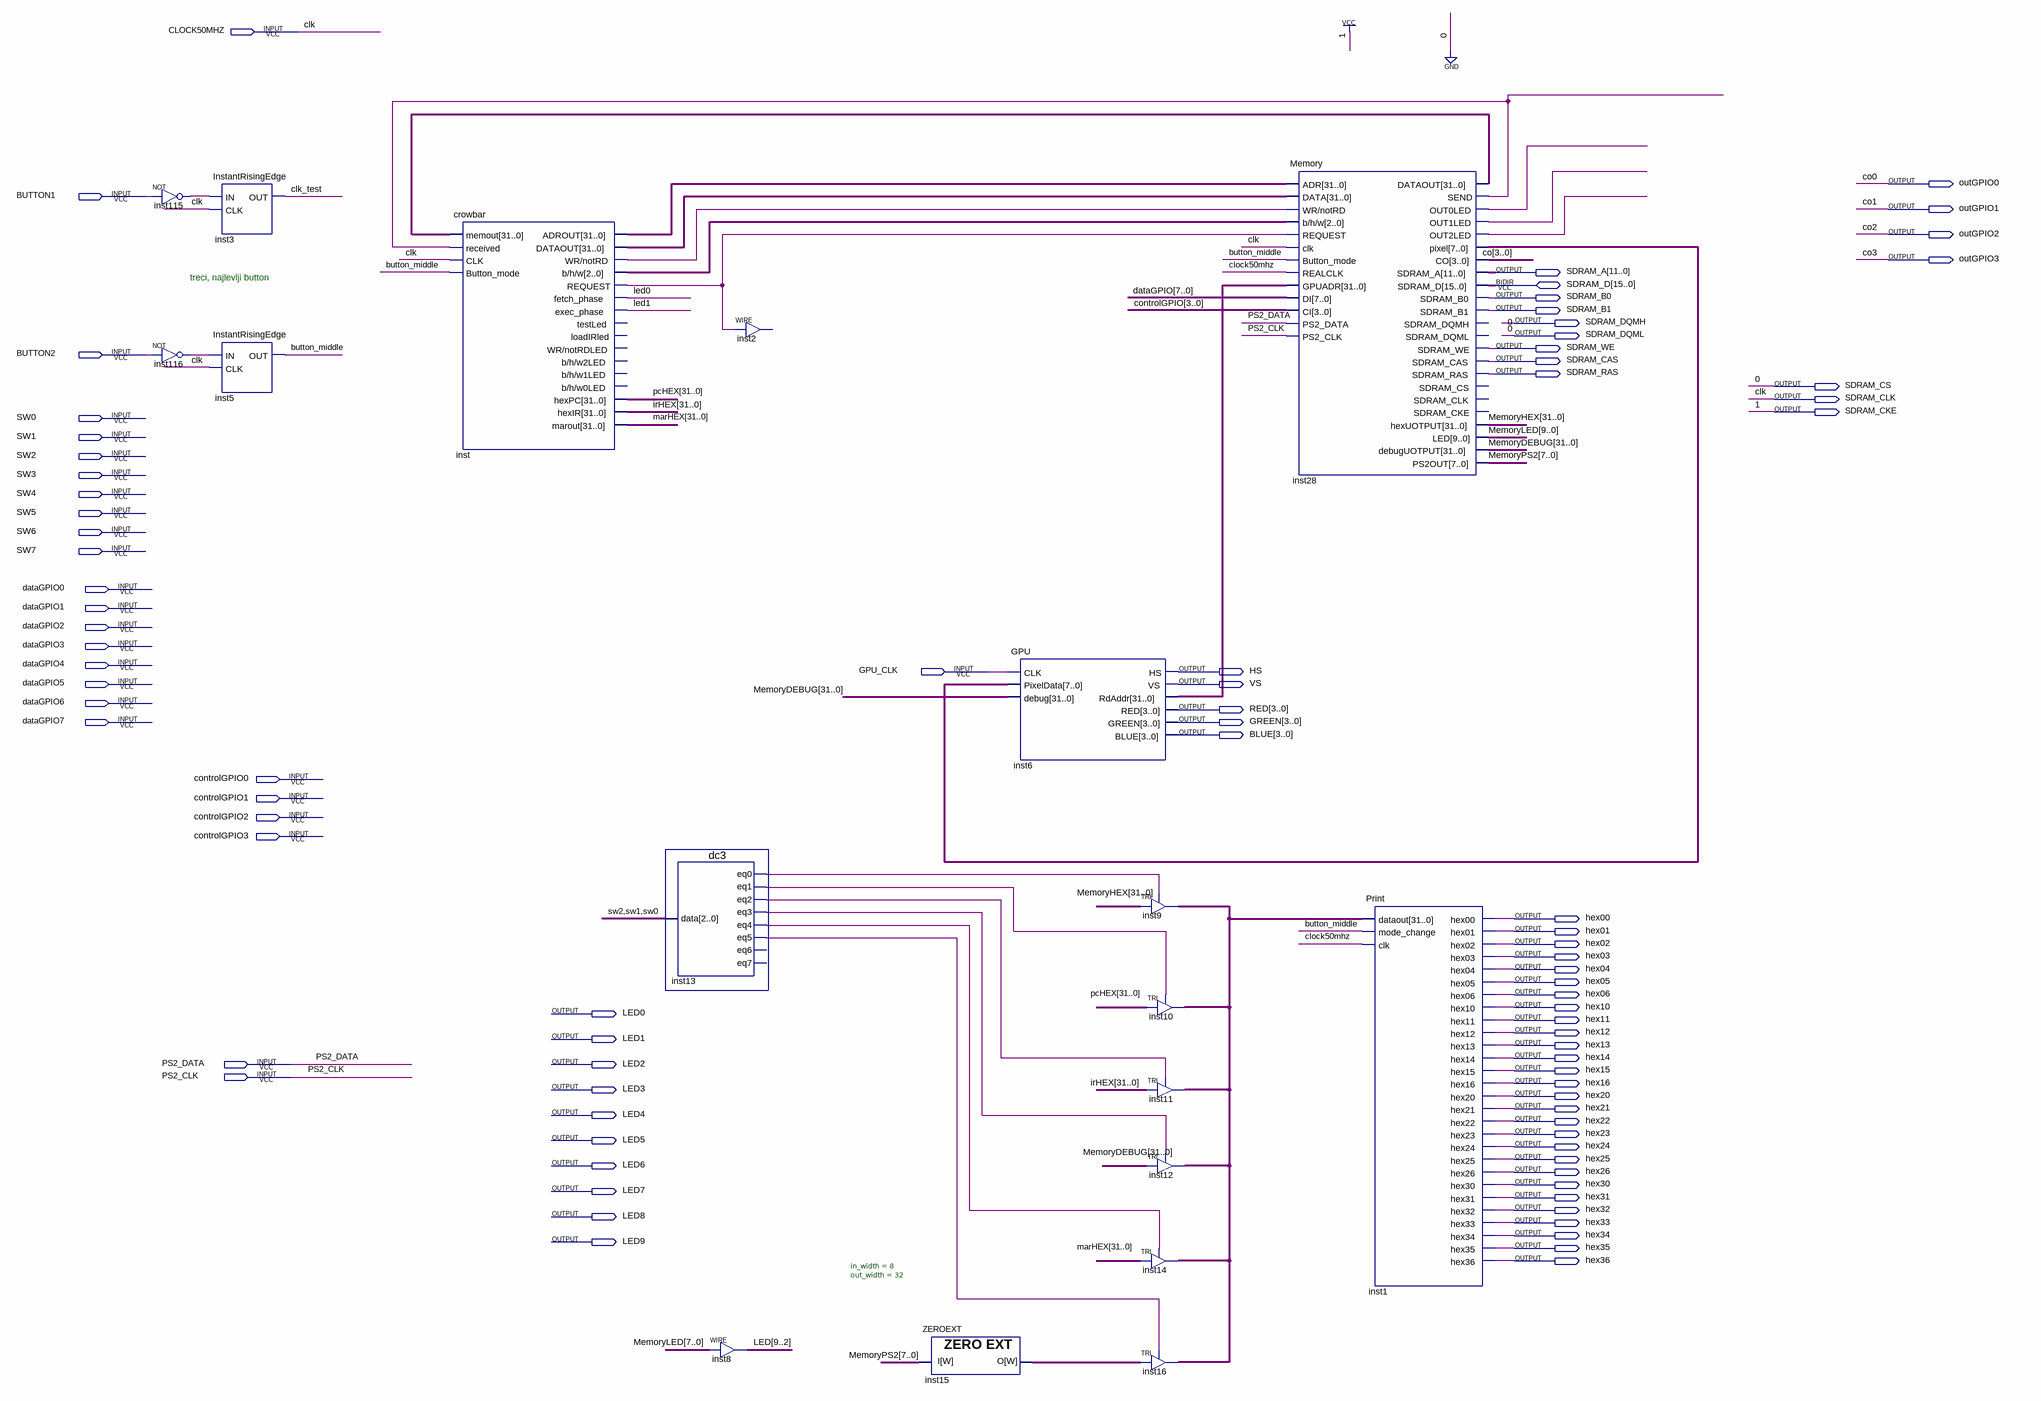
[diagram p0: schematic sheet]
// Quartus schematic MainScheme.bdf as structural Verilog: 18 symbols, 85 pins
module MainScheme (
  input  CLOCK50MHZ,
  input  BUTTON1,
  input  BUTTON2,
  input  SW0,
  input  SW1,
  input  SW2,
  input  SW3,
  input  SW4,
  input  SW5,
  input  SW6,
  input  SW7,
  input  dataGPIO0,
  input  dataGPIO1,
  input  dataGPIO2,
  input  dataGPIO3,
  input  dataGPIO4,
  input  GPU_CLK,
  input  dataGPIO5,
  input  dataGPIO6,
  input  dataGPIO7,
  input  controlGPIO0,
  input  controlGPIO1,
  input  controlGPIO2,
  input  controlGPIO3,
  input  PS2_DATA,
  input  PS2_CLK,
  inout  [15:0] SDRAM_D,
  output outGPIO0,
  output outGPIO1,
  output outGPIO2,
  output outGPIO3,
  output [11:0] SDRAM_A,
  output SDRAM_B0,
  output SDRAM_B1,
  output SDRAM_DQMH,
  output SDRAM_DQML,
  output SDRAM_WE,
  output SDRAM_CAS,
  output SDRAM_RAS,
  output SDRAM_CS,
  output SDRAM_CLK,
  output SDRAM_CKE,
  output HS,
  output VS,
  output [3:0] RED,
  output [3:0] GREEN,
  output [3:0] BLUE,
  output hex00,
  output hex01,
  output hex02,
  output hex03,
  output hex04,
  output hex05,
  output hex06,
  output hex10,
  output LED0,
  output hex11,
  output hex12,
  output LED1,
  output hex13,
  output hex14,
  output LED2,
  output hex15,
  output hex16,
  output LED3,
  output hex20,
  output hex21,
  output LED4,
  output hex22,
  output hex23,
  output LED5,
  output hex24,
  output hex25,
  output LED6,
  output hex26,
  output hex30,
  output LED7,
  output hex31,
  output hex32,
  output LED8,
  output hex33,
  output hex34,
  output LED9,
  output hex35,
  output hex36
);

  wire button_middle, clk_test, inst13_eq0, inst13_eq1, inst13_eq2, inst13_eq3, inst13_eq4, inst13_eq5,
       inst28_out0led, inst28_out1led, inst28_out2led, inst28_send, inst115_out, inst116_out, inst_request,
       inst_wr_notrd;
  wire [2:0] inst_b_h_w;
  wire [7:0] inst28_pixel, MemoryPS2;
  wire [9:0] MemoryLED;
  wire [31:0] inst6_rdaddr, inst9_out, inst15_o, inst28_dataout, inst_adrout, inst_dataout, irHEX, marHEX,
       MemoryDEBUG, MemoryHEX, pcHEX;

  not inst115 (inst115_out, BUTTON1);
  not inst116 (inst116_out, BUTTON2);
  InstantRisingEdge inst3 (.IN(inst115_out), .CLK(CLOCK50MHZ), .OUT(clk_test));
  InstantRisingEdge inst5 (.IN(inst116_out), .CLK(CLOCK50MHZ), .OUT(button_middle));
  crowbar inst (
    .memout(inst28_dataout), .received(inst28_send), .CLK(CLOCK50MHZ), .Button_mode(button_middle),
    .ADROUT(inst_adrout), .DATAOUT(inst_dataout), .\WR/notRD (inst_wr_notrd), .\b/h/w (inst_b_h_w),
    .REQUEST(inst_request), .fetch_phase(LED0), .exec_phase(LED1), .hexPC(pcHEX), .hexIR(irHEX),
    .marout(marHEX));  // open: testLed, loadIRled, WR/notRDLED, b/h/w2LED, b/h/w1LED, b/h/w0LED
  dc3 inst13 (
    .data({SW2, SW1, SW0}), .eq0(inst13_eq0), .eq1(inst13_eq1), .eq2(inst13_eq2), .eq3(inst13_eq3),
    .eq4(inst13_eq4), .eq5(inst13_eq5));  // open: eq6, eq7
  // WIRE inst2 has open pins
  assign {LED9, LED8, LED7, LED6, LED5, LED4, LED3, LED2} = MemoryLED[7:0];  // WIRE inst8
  ZEROEXT #(.in_width(8), .out_width(32)) inst15 (.I(MemoryPS2), .O(inst15_o));
  GPU inst6 (
    .CLK(GPU_CLK), .PixelData(inst28_pixel), .debug(MemoryDEBUG), .HS(HS), .VS(VS), .RdAddr(inst6_rdaddr),
    .RED(RED), .GREEN(GREEN), .BLUE(BLUE));
  TRI inst9[31:0] (.IN(MemoryHEX), .OE(inst13_eq0), .OUT(inst9_out));
  TRI inst10[31:0] (.IN(pcHEX), .OE(inst13_eq1), .OUT(inst9_out));
  TRI inst11[31:0] (.IN(irHEX), .OE(inst13_eq2), .OUT(inst9_out));
  TRI inst12[31:0] (.IN(MemoryDEBUG), .OE(inst13_eq3), .OUT(inst9_out));
  TRI inst14[31:0] (.IN(marHEX), .OE(inst13_eq4), .OUT(inst9_out));
  TRI inst16[31:0] (.IN(inst15_o), .OE(inst13_eq5), .OUT(inst9_out));
  Memory inst28 (
    .ADR(inst_adrout), .DATA(inst_dataout), .\WR/notRD (inst_wr_notrd), .\b/h/w (inst_b_h_w),
    .REQUEST(inst_request), .clk(CLOCK50MHZ), .Button_mode(button_middle), .REALCLK(CLOCK50MHZ),
    .GPUADR(inst6_rdaddr),
    .DI({dataGPIO7, dataGPIO6, dataGPIO5, dataGPIO4, dataGPIO3, dataGPIO2, dataGPIO1, dataGPIO0}),
    .CI({controlGPIO3, controlGPIO2, controlGPIO1, controlGPIO0}), .PS2_DATA(PS2_DATA), .PS2_CLK(PS2_CLK),
    .DATAOUT(inst28_dataout), .SEND(inst28_send), .OUT0LED(inst28_out0led), .OUT1LED(inst28_out1led),
    .OUT2LED(inst28_out2led), .pixel(inst28_pixel), .CO({outGPIO3, outGPIO2, outGPIO1, outGPIO0}),
    .SDRAM_A(SDRAM_A), .SDRAM_B0(SDRAM_B0), .SDRAM_B1(SDRAM_B1), .SDRAM_WE(SDRAM_WE), .SDRAM_CAS(SDRAM_CAS),
    .SDRAM_RAS(SDRAM_RAS), .hexUOTPUT(MemoryHEX), .LED(MemoryLED), .debugUOTPUT(MemoryDEBUG),
    .PS2OUT(MemoryPS2), .SDRAM_D(SDRAM_D));  // open: SDRAM_DQMH, SDRAM_DQML, SDRAM_CS, SDRAM_CLK, SDRAM_CKE
  Print inst1 (
    .dataout(inst9_out), .mode_change(button_middle), .clk(CLOCK50MHZ), .hex00(hex00), .hex01(hex01),
    .hex02(hex02), .hex03(hex03), .hex04(hex04), .hex05(hex05), .hex06(hex06), .hex10(hex10), .hex11(hex11),
    .hex12(hex12), .hex13(hex13), .hex14(hex14), .hex15(hex15), .hex16(hex16), .hex20(hex20), .hex21(hex21),
    .hex22(hex22), .hex23(hex23), .hex24(hex24), .hex25(hex25), .hex26(hex26), .hex30(hex30), .hex31(hex31),
    .hex32(hex32), .hex33(hex33), .hex34(hex34), .hex35(hex35), .hex36(hex36));

  assign SDRAM_CKE = 1'b1;
  assign SDRAM_CLK = CLOCK50MHZ;
  assign SDRAM_CS = 1'b0;
  assign SDRAM_DQMH = 1'b0;
  assign SDRAM_DQML = 1'b0;

  // Other names for the same wires on the sheet: clk = CLOCK50MHZ; co[3:0] = {outGPIO3, outGPIO2, outGPIO1, outGPIO0};
  //   co0 = outGPIO0; co1 = outGPIO1; co2 = outGPIO2; co3 = outGPIO3

  // Notes on the sheet:
  //   treci, najlevlji button
endmodule
